# Altium schematic sheet nfc-epd-afe.SchDoc
size Letter; CurrentDate: 10/10/2014
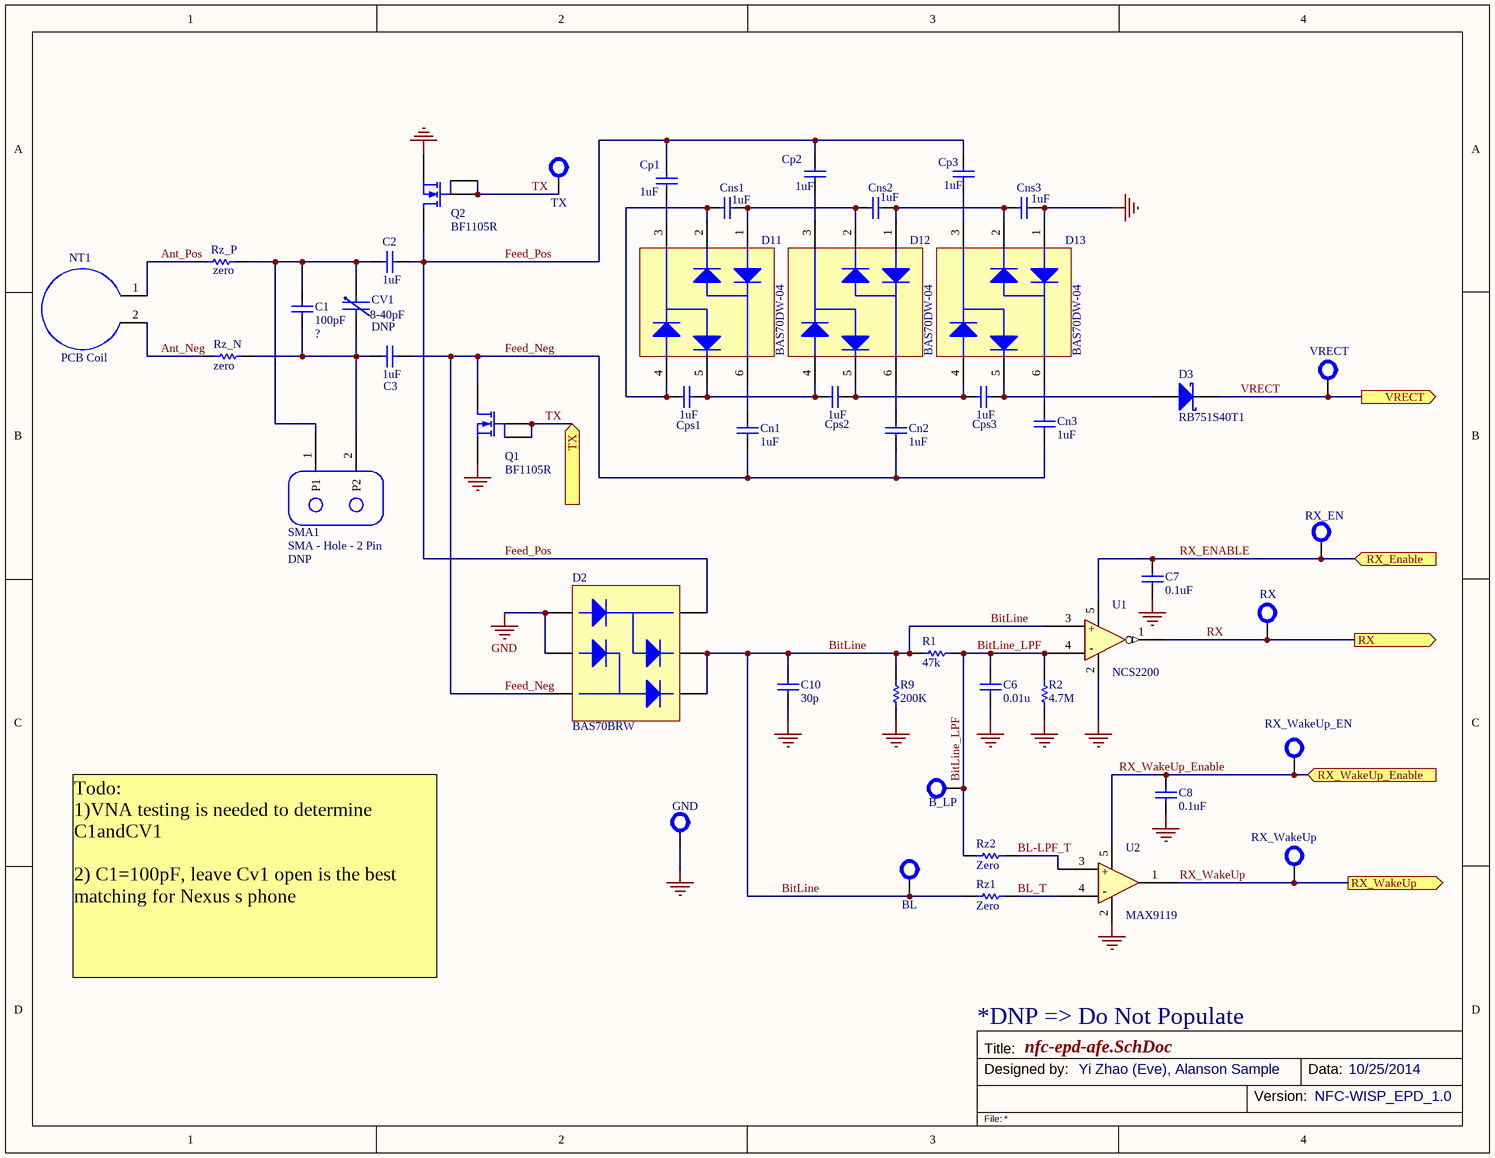
[diagram p0: nfc-epd-afe.SchDoc]

## Parts
B_LP  Test Point  [Test Point - Small]  (value not drawn)
BL  Test Point  [Test Point - Small]  (value not drawn)
C1  Note: 100pF  [0603]  (hidden comment: Cap)
C2  value 1uF  [0603]  (hidden comment: Cap)
C3  value 1uF  [0603]  (hidden comment: Cap)
C6  value 0.01u  [0603]  (hidden comment: Cap)
C7  value 0.1uF  [0603]  (hidden comment: Cap)
C8  value 0.1uF  [0603]  (hidden comment: Cap)
C10  value 30p  [0603]  (hidden comment: Cap)
Cn1  value 1uF  [0603]  (hidden comment: Cap)
Cn2  value 1uF  [0603]  (hidden comment: Cap)
Cn3  value 1uF  [0603]  (hidden comment: Cap)
Cns1  value 1uF  [0603]  (hidden comment: Cap)
Cns2  value 1uF  [0603]  (hidden comment: Cap)
Cns3  value 1uF  [0603]  (hidden comment: Cap)
Cp1  value 1uF  [0603]  (hidden comment: Cap)
Cp2  value 1uF  [0603]  (hidden comment: Cap)
Cp3  value 1uF  [0603]  (hidden comment: Cap)
Cps1  value 1uF  [0603]  (hidden comment: Cap)
Cps2  value 1uF  [0603]  (hidden comment: Cap)
Cps3  value 1uF  [0603]  (hidden comment: Cap)
CV1  value 8-40pF  Note: DNP  [Var-Cap - GKY40056]  (hidden comment: GKY40056)
D2  BAS70BRW  [SOT-363]
D3  RB751S40T1  [SOD-523]
D11  BAS70DW-04  [SOT-363]
D12  BAS70DW-04  [SOT-363]
D13  BAS70DW-04  [SOT-363]
GND0  GND  [Test Point - Small]
NT1  PCB Coil  [Net Tie - 50mil]  (net tie, no BOM)
Q1  BF1105R  [SOT-143R]
Q2  BF1105R  [SOT-143R]
R1  value 47k  [0603]  (hidden comment: Res)
R2  value 4.7M  [0603]  (hidden comment: Res)
R9  value 200K  [0603]  (hidden comment: Res)
RX  Test Point  [Test Point - Small]  (value not drawn)
RX_EN  Test Point  [Test Point - Small]  (value not drawn)
RX_WakeUp  Test Point  [Test Point - Small]  (value not drawn)
RX_WakeUp_EN  Test Point  [Test Point - Small]  (value not drawn)
Rz1  value Zero  [0603]  (hidden comment: Res)
Rz2  value Zero  [0603]  (hidden comment: Res)
Rz_N  value zero  [0603]  (hidden comment: Res)
Rz_P  value zero  [0603]  (hidden comment: Res)
SMA1  SMA - Hole - 2 Pin  Note: DNP  [SMA - Hole - 2 Pin]
TX  Test Point  [Test Point - Small]  (value not drawn)
U1  NCS2200  [SC70-5]
U2  MAX9119  [SC70-5]
VRECT  Test Point  [Test Point - Small]  (value not drawn)

## Ports
RX (out), RX_Enable (in), RX_WakeUp (out), RX_WakeUp_Enable (in), TX (in), VRECT (out)

## Nets
GND: C6.2 C7.2 C8.2 C10.2 Cns3.1 D2.1(A1) D2.2(A2) D13.1(A1) GND0.0 Q1.1(S) Q2.1(S) R2.2 R9.2 U1.2(Gnd) U2.2(VEE)
Ant_Neg: NT1.2(N2) Rz_N.1
Ant_Pos: NT1.1(N1) Rz_P.1
BitLine: BL.0 C10.1 D2.4(C2) D2.5(C1) R1.1 R9.1 Rz1.1 U1.3(IN+)
BitLine_LPF: B_LP.0 C6.1 R1.2 R2.1 Rz2.1 U1.4(In-)
BL-LPF_T: Rz2.2 U2.3(IN+)
BL_T: Rz1.2 U2.4(In-)
Feed_Neg: C3.2 Cn1.1 Cn2.1 Cn3.1 D2.3(AC2) Q1.2(D)
Feed_Pos: C2.2 Cp1.2 Cp2.2 Cp3.2 D2.6(AC1) Q2.2(D)
RX: RX.0 U1.1(OUT) ; port RX
RX_ENABLE: C7.1 RX_EN.0 U1.5(VDD) ; port RX_Enable
RX_WakeUp: RX_WakeUp.0 U2.1(OUT) ; port RX_WakeUp
RX_WakeUp_Enable: C8.1 RX_WakeUp_EN.0 U2.5(VCC) ; port RX_WakeUp_Enable
TX: Q1.3(G) Q1.4(G) Q2.3(G) Q2.4(G) TX.0 ; port TX
VRECT: D3.2(C) VRECT.0 ; port VRECT
NetC1_1: C1.1 C2.1 CV1.1 Rz_P.2 SMA1.1(P1)
NetC1_2: C1.2 C3.1 CV1.2 Rz_N.2 SMA1.2(P2)
NetCn1_2: Cn1.2 D11.6(AC)
NetCn2_2: Cn2.2 D12.6(AC)
NetCn3_2: Cn3.2 D13.6(AC)
NetCns1_1: Cns1.1 Cns2.2 D11.1(A1) D12.2(C1)
NetCns1_2: Cns1.2 Cps1.2 D11.2(C1) D11.4(A2)
NetCns2_1: Cns2.1 Cns3.2 D12.1(A1) D13.2(C1)
NetCp1_1: Cp1.1 D11.3(AC2)
NetCp2_1: Cp2.1 D12.3(AC2)
NetCp3_1: Cp3.1 D13.3(AC2)
NetCps1_1: Cps1.1 Cps2.2 D11.5(C2) D12.4(A2)
NetCps2_1: Cps2.1 Cps3.2 D12.5(C2) D13.4(A2)
NetCps3_1: Cps3.1 D3.1(A) D13.5(C2)

## Notes on the sheet
- Todo:
  1)VNA testing is needed to determine C1andCV1
  2) C1=100pF, leave Cv1 open is the best matching for Nexus s phone
- *DNP => Do Not Populate
- Title:
- Designed by:
- Yi Zhao (Eve), Alanson Sample
- Version:
- Data:
- NFC-WISP_EPD_1.0
- 10/25/2014
- File:
- (in symbol MAX9119) +; -
- (in symbol NCS2200) +; -

## Library data of the parts
B_LP BL GND0 RX RX_EN RX_WakeUp RX_WakeUp_EN TX VRECT = Test Point: Test Point, large or small foot prints; Manufacturer Part Number: Example: 5000, 5013; Manufacturer: Keystone Electronics; Digi-Key Part Number: Example: 5000K-ND, 5012K-ND, Surface mount 5015KCT-ND; Rating: *; Value: *
  B_LP BL RX RX_EN RX_WakeUp RX_WakeUp_EN TX: Note: *
C1 C6-C8 C10 = Cap: Ceramic Capacitor (Surface Mount); Manufacturer: Generic Ceramic Chip Cap (TBD); Digi-Key Part Number: *; Manufacturer Part Number: *; Rating: *
  C1: Value: ?
  C6: Note: *; Supplier 1: Digi-Key; Supplier Part Number 1: 490-1512-1-ND
  C7 C8 C10: Note: *
C2 C3 Cn1-Cn3 Cns1-Cns3 Cp1-Cp3 Cps1-Cps3 = Cap: Ceramic Capacitor (Surface Mount); Manufacturer: Generic Ceramic Chip Cap (TBD); Manufacturer Part Number 1: 0603ZD105KAT2A; Digi-Key Part Number: *; Note: *; Rating: *; Supplier Part Number 1: 478-1251-1-1ND; Supplier 1: Digikey
  Cp1: Supplier 1: Digi-Key; Supplier Part Number 1: 478-1251-1-ND
  Cps1: 478-1251-1-1ND: 478-1251-1-1ND
CV1 = Var-Cap/603: Var-Cap Sprague-Goodman GKY40056; Digi-Key Part Number: SG9013CT-ND; Manufacturer Part Number: GKY40056; Manufacturer: Sprague-Goodman; Rating: *
D2 = Diode - Array_2: Diode Array - 2 Pair Series Connection; Manufacturer: Diodes Inc; Manufacturer Part Number: BAS70BRW-7-F; Note: *; Digi-Key Part Number: BAS70BRW-7FDICT-ND; Value: *; Rating: *
D3 = RB751S40T1: Schottky Diode; Published: 8-Jun-2000; LatestRevisionDate: 17-Jul-2002; LatestRevisionNote: Re-released for DXP Platform.; PackageReference: SMB; Publisher: Altium Limited; Code_JEDEC: DO-214-AA; Supplier 1: Digi-Key; Supplier Part Number 1: RB751S40T1GOSCT-ND
D11-D13 = Diode - Array_2_1: Diode Array - 2 Pair Series Connection; Manufacturer: Diodes Inc; Manufacturer Part Number: BAS70DW-04-7-F; Note: *; Digi-Key Part Number: BAS70DW-04FDICT-ND; Value: *; Rating: *; Supplier 1: Digi-Key; Supplier Part Number 1: BAS70DW-04FDICT-ND
NT1 = Net Tie - Coil: Hand draw coil symbol based on a 'Net Tie'; Note: A Net Tie is an element that allows two differnt nets to be connected (shorted) together.
Q1 Q2 = BF1105R: SOT-143R, N-Channel Dual-Gate Mos-Fets MOSFET; Manufacturer Part Number: BF1105R,215; Manufacturer: NXP Semiconductors; Rating: *; Value: *; Note: *; Supplier 1: Mouser; Supplier Part Number 1: 771-BF1105R,215
  Q1: Digi-Key Part Number: BF1105R,215-ND
R1 R2 R9 = Res: Chip Resistor (Surface Mount); Manufacturer: Generic Chip Res (TBD); Manufacturer Part Number: *; Digi-Key Part Number: *; Rating: *
Rz1 Rz2 Rz_N Rz_P = Res: Chip Resistor (Surface Mount); Manufacturer: Generic Chip Res (TBD); Manufacturer Part Number: RC0603FR-070RL; Digi-Key Part Number: *; Rating: *; Supplier 1: Digi-Key; Supplier Part Number 1: 311-0.0HRCT-ND
  Rz_N Rz_P: Note: *
SMA1 = SMA - Hole - 2 Pin: Two pin SMA connector wisp
U1 = NCS2200: Comparator: On Semi 10uA Comparator; Manufacturer: ON Semiconductor; Manufacturer Part Number: NCS2200SQ2T2G; Digi-Key Part Number: NCS2200SQ2T2GOSTR-ND; Rating: *; Value: *; Note: *; Supplier 1: Digi-Key; Supplier Part Number 1: NCS2200SQ2T2GOSCT-ND
U2 = MAX9119: IC COMPARATOR BTR SC70-5, 350nA; Manufacturer: Maxim Integrated; Manufacturer Part Number: MAX9119EXK+T; Digi-Key Part Number: MAX9119EXK+TCT-ND; Rating: *; Value: *; Note: *; Supplier 1: Digi-Key; Supplier Part Number 1: MAX9119EXK+TCT-ND